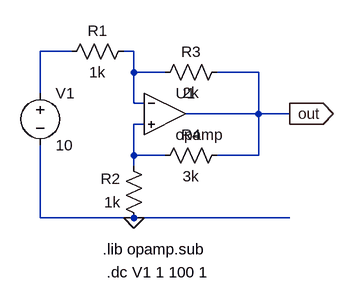
[diagram p0: schematic p1.asc]
p1.asc, the LTspice schematic file:
Version 4
SHEET 1 880 680
WIRE 96 64 48 64
WIRE 192 64 176 64
WIRE 192 96 192 64
WIRE 240 96 192 96
WIRE 384 96 320 96
WIRE 48 128 48 64
WIRE 192 144 192 96
WIRE 208 144 192 144
WIRE 384 160 384 96
WIRE 384 160 272 160
WIRE 432 160 384 160
WIRE 208 176 192 176
WIRE 192 224 192 176
WIRE 240 224 192 224
WIRE 384 224 384 160
WIRE 384 224 320 224
WIRE 192 240 192 224
WIRE 48 320 48 208
WIRE 192 320 48 320
WIRE 432 320 192 320
FLAG 192 320 0
FLAG 432 160 out
IOPIN 432 160 Out
SYMBOL voltage 48 112 R0
WINDOW 123 0 0 Left 2
WINDOW 39 0 0 Left 2
SYMATTR InstName V1
SYMATTR Value 10
SYMBOL res 192 48 R90
WINDOW 0 0 56 VBottom 2
WINDOW 3 32 56 VTop 2
SYMATTR InstName R1
SYMATTR Value 1k
SYMBOL Opamps\\opamp 240 96 R0
SYMATTR InstName U1
SYMBOL res 208 336 R180
WINDOW 0 36 76 Left 2
WINDOW 3 36 40 Left 2
SYMATTR InstName R2
SYMATTR Value 1k
SYMBOL res 224 112 R270
WINDOW 0 32 56 VTop 2
WINDOW 3 0 56 VBottom 2
SYMATTR InstName R3
SYMATTR Value 2k
SYMBOL res 336 208 R90
WINDOW 0 0 56 VBottom 2
WINDOW 3 32 56 VTop 2
SYMATTR InstName R4
SYMATTR Value 3k
TEXT 144 368 Left 2 !.lib opamp.sub
TEXT 150 404 Left 2 !.dc V1 1 100 1

The netlist it stands for:
* p1.asc
V1 N001 0 10
R1 N002 N001 1k
XU1 N002 N003 out opamp Aol=100K GBW=10Meg  ; pins invin noninvin out
R2 0 N003 1k
R3 N002 out 2k
R4 out N003 3k
.lib opamp.sub
.dc V1 1 100 1
.backanno
.end